# EAGLE design BMS Microcontroller (EAGLE 7.7.0)
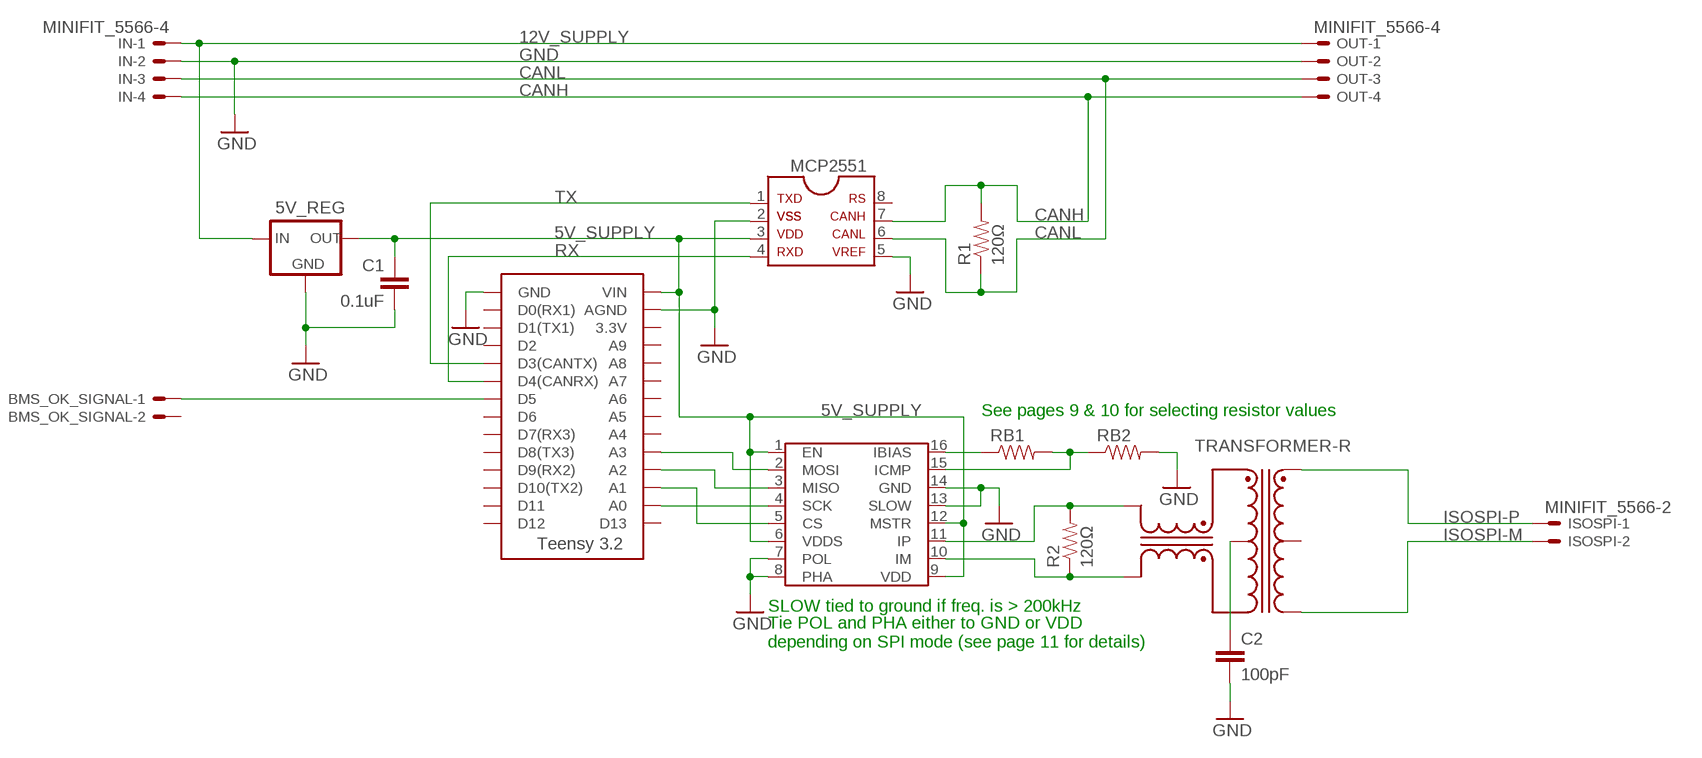
[diagram p0: schematic, sheet 1]

## Parts
5V_REG  5V_REGULATOR_LM340-NLM340MPX-5.0/NOPB  [SOT223]
BMS_OK_SIGNAL  MINIFIT_5566-2  [MINIFIT_5566-2]
C1  0.1uF  CAP0805  [0805]
C2  100pF  CAP0805  [0805]
IN  MINIFIT_5566-4  [MINIFIT_5566-4]
ISOSPI  MINIFIT_5566-2  [MINIFIT_5566-2]
MCP2551  MCP2551  [SOIC-08]
OUT  MINIFIT_5566-4  [MINIFIT_5566-4]
R1  120Ω  RESISTOR0805-RES  [0805]
R2  120Ω  RESISTOR0805-RES  [0805]
RB1  RESISTOR0805-RES  [0805]
RB2  RESISTOR0805-RES  [0805]
TRANSFORMER-  TRANSFORMER_749010013  [749010013]
U$1  LTC6820  [LTC6820]
U$3  TEENSY_3.2_SIMPLE  [TEENSY_3.2_SIMPLE]

## Nets
5V_SUPPLY: 5V_REG.3(OUT) C1.1 MCP2551.3 U$1.1(EN) U$1.6(VDDS) U$1.9(VDD) U$1.12(MSTR) U$3.VIN
12V_SUPPLY: 5V_REG.1(IN) IN.1 OUT.1
CANH: IN.4 MCP2551.7 OUT.4 R1.2
CANL: IN.3 MCP2551.6 OUT.3 R1.1
GND: 5V_REG.2(GND) 5V_REG.4(GND) C1.2 C2.2 IN.2 MCP2551.2 MCP2551.5 OUT.2 RB2.2 U$1.7(POL) U$1.8(PHA) U$1.13(SLOW) U$1.14(GND) U$3.AGND U$3.GND
ISOSPI-M: ISOSPI.2 TRANSFORMER-.8(R:D-)
ISOSPI-P: ISOSPI.1 TRANSFORMER-.6(R:D+)
N$1: U$1.5(CS) U$3.A1
N$2: U$1.4(SCK) U$3.A0
N$3: U$1.3(MISO) U$3.A2
N$4: U$1.2(MOSI) U$3.A3
N$5: C2.1 TRANSFORMER-.10(R:CX)
N$6: RB1.1 U$1.16(IBIAS)
N$7: RB1.2 RB2.1 U$1.15(ICMP)
N$8: R2.2 TRANSFORMER-.11(R:X+) U$1.11(IP)
N$9: R2.1 TRANSFORMER-.9(R:X-) U$1.10(IM)
N$10: BMS_OK_SIGNAL.1 U$3.D5
RX: MCP2551.4 U$3.D4(CANRX)
TX: MCP2551.1 U$3.D3(CANTX)
Unconnected: BMS_OK_SIGNAL.2 MCP2551.8 TRANSFORMER-.1(T:D+) TRANSFORMER-.2(T:CD) TRANSFORMER-.3(T:D-) TRANSFORMER-.7(R:CD) TRANSFORMER-.14(T:X-) TRANSFORMER-.15(T:CX) TRANSFORMER-.16(T:X+) U$3.3.3V U$3.A4 U$3.A5 U$3.A6 U$3.A7 U$3.A8 U$3.A9 U$3.D0(RX1) U$3.D1(TX1) U$3.D2 U$3.D6 U$3.D7(RX3) U$3.D8(TX3) U$3.D9(RX2) U$3.D10(TX2) U$3.D11 U$3.D12 U$3.D13

## Notes on the sheet
- See pages 9 & 10 for selecting resistor values
- SLOW tied to ground if freq. is > 200kHz
- Tie POL and PHA either to GND or VDD
  depending on SPI mode (see page 11 for details)

## Library data of the parts
5V_REG = HyTechDevices:5V_REGULATOR_LM340-N: Voltage Regulator 5v linear voltage regulator Datasheet <http://www.mouser.com/ProductDetail/Texas-Instruments/LM340MPX-50-NOPB/?qs=X1J7HmVL2ZGZwtTFRQ9ItA%3D%3D> MAX current out: 1.5A MAX voltage in: 35V
BMS_OK_SIGNAL ISOSPI = HyTechDevices:MINIFIT_5566-2: Mini-Fit Junior connector 2 pole Source: http://www.molex.com; OC_FARNELL: 1822072; OC_NEWARK: unknown
C1 C2 = HyTechDevices:CAP: Capacitor Standard 0603 ceramic capacitor, and 0.1" leaded capacitor.
IN OUT = HyTechDevices:MINIFIT_5566-4: Mini-Fit Junior connector 4 pole Source: http://www.molex.com; OC_FARNELL: unknown; OC_NEWARK: unknown
MCP2551 = HyTechDevices:MCP2551: MCP2551 High-Speed CAN Transceiver Product Webpage <https://www.microchip.com/wwwproducts/en/MCP2551> Datasheet <http://ww1.microchip.com/downloads/en/DeviceDoc/21667f.pdf> This device is outdated It is replaced by MCP2561. Comparison Page <https://www.microchip.com/wwwproducts/ProductCompare/MCP2551/MCP2561> Product Webpage <https://www.microchip.com/wwwproducts/en/MCP2561> Datasheet <http://ww1.microchip.com/downloads/en/DeviceDoc/20005167C.pdf>
R1 R2 RB1 RB2 = HyTechDevices:RESISTOR: Resistor Basic schematic elements and footprints for 0603, 1206, and PTH resistors.
TRANSFORMER- = HyTechDevices:TRANSFORMER_749010013: Wurth Electronics Midcom 749010013 10/100BaseTX Ethernet Transformer Datasheet <http://www.mouser.com/ds/2/445/749010013-311000.pdf> Mouser Page <http://www.mouser.com/ProductDetail/Wurth-Electronics-Midcom/749010013/?qs=40TFAHZMFvcjCZphxWYgVw%3D%3D>
U$1 = HyTechDevices:LTC6820: Linear Technology LTC6820 isoSPI Isolated Communications Interface Datasheet <http://cds.linear.com/docs/en/datasheet/6820fa.pdf>
U$3 = HyTechDevices:TEENSY_3.2_SIMPLE: Simple version of the Teensy 3.2 board that only uses the 2 main rows of pins, not the inner pins or the pins opposite the usb port.

## Board
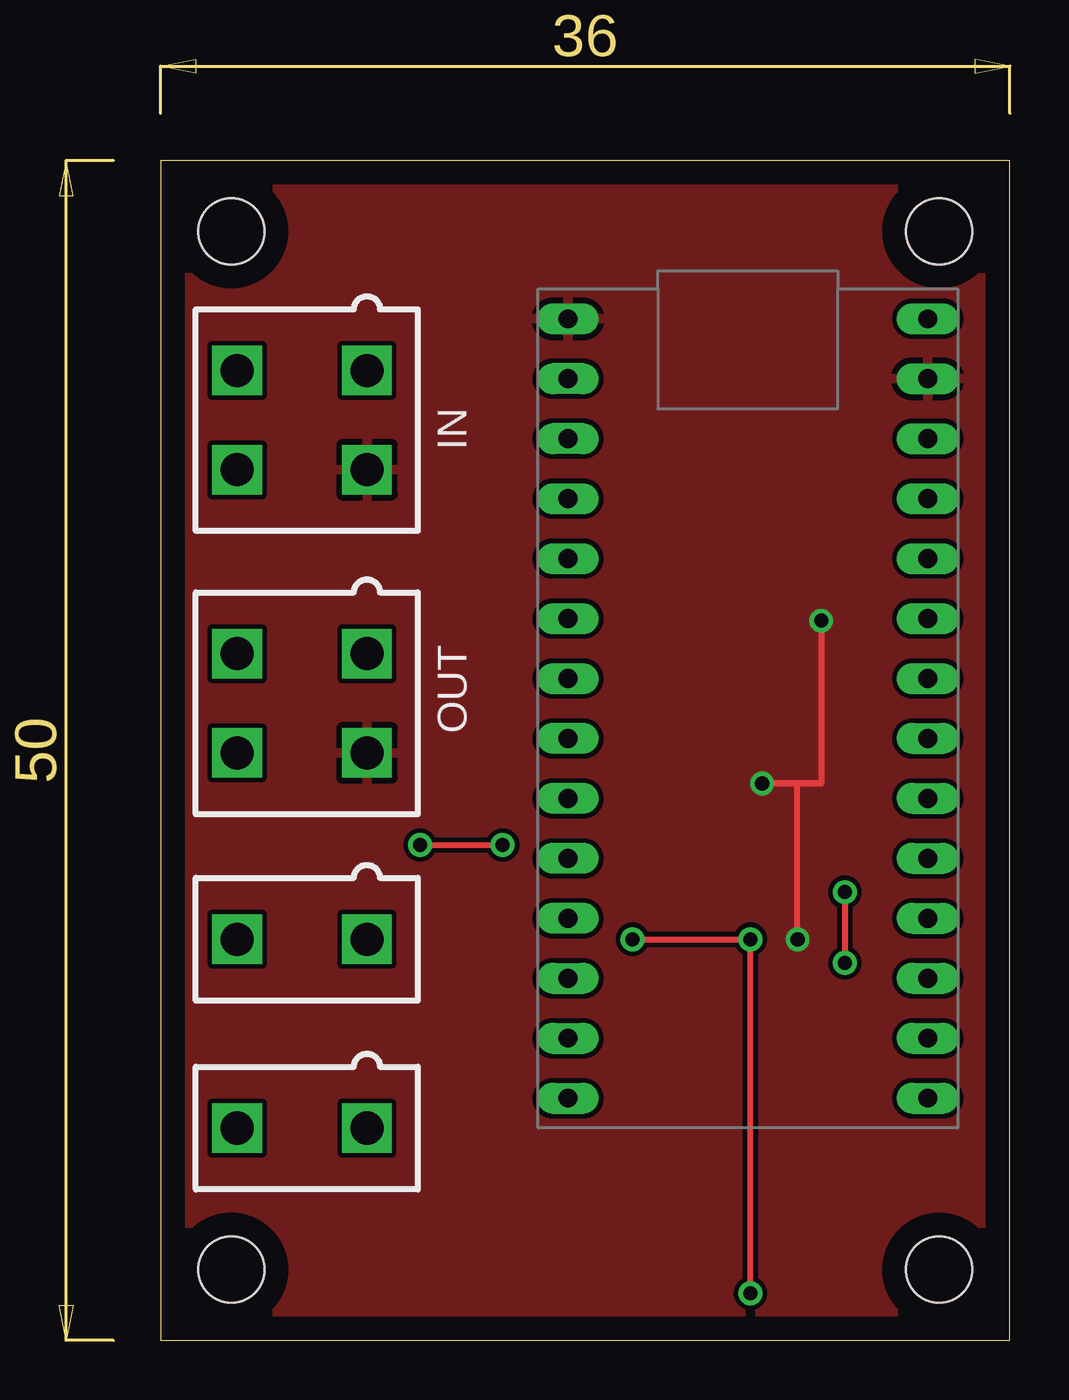
[diagram p1: board, top side]
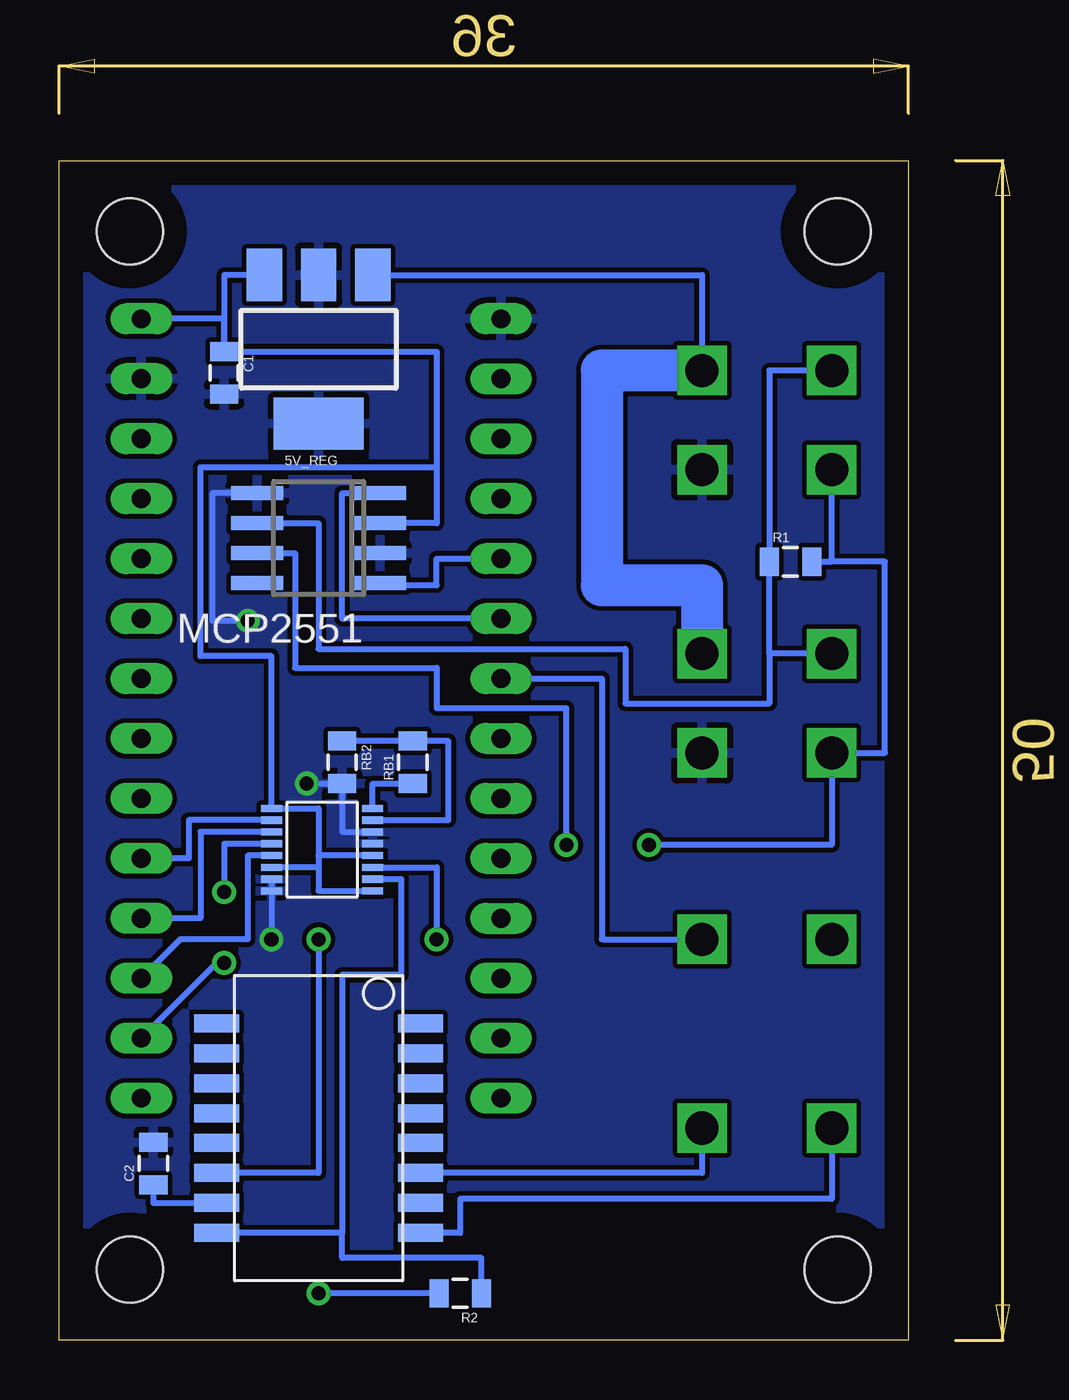
[diagram p2: board, bottom side, seen from below]

Size 36 x 50 mm. Coordinates in mm from the lower left corner, seen from the top.
Outline: 0,0 36,0 36,50 0,50 0,0
Copper layers (1*16): Top 0.035mm / dielectric 1.5mm / Bottom 0.035mm
Design rules "default": minimum track width 10mil, minimum drill 24mil, track to track 8mil, track to pad 8mil, pad to pad 8mil, via to via 8mil, smd to smd 8mil, copper to edge 40mil, drill to drill 8mil, minimum pad ring 10mil, minimum via ring 8mil, stop-mask expansion 4mil, vias tented up to drill 0mil, thermal gap 10mil
Holes 2.8 mm at 3,47 33,47 3,3 33,3

### Footprints (pad centres in the part's own frame; a part is rotated, then mirrored left to right if it is on the bottom)
SOT223 = smd 1.5 x 2.235: 1 -2.3,-3.15; 2 0,-3.15; 3 2.3,-3.15 | smd 3.8 x 2.2: 4 0,3.15
MINIFIT_5566-2 = drill 1.4 square: 1 0,-2.75; 2 0,2.75
0805 = smd 0.8 x 1.2: 1 -0.9,0; 2 0.9,0
MINIFIT_5566-4 = drill 1.4 square: 1 2.1,-2.75; 2 -2.1,-2.75; 3 2.1,2.75; 4 -2.1,2.75
SOIC-08 = smd 0.6 x 2.2: 1 -1.905,-2.6; 2 -0.635,-2.6; 3 0.635,-2.6; 4 1.905,-2.6; 5 1.905,2.6; 6 0.635,2.6; 7 -0.635,2.6; 8 -1.905,2.6
749010013 = smd 1.905 x 0.762: 1 4.318,4.445; 2 4.318,3.175; 3 4.318,1.905; 4 4.318,0.635; 5 4.318,-0.635; 6 4.318,-1.905; 7 4.318,-3.175; 8 4.318,-4.445; 9 -4.318,-4.445; 10 -4.318,-3.175; 11 -4.318,-1.905; 12 -4.318,-0.635; 13 -4.318,0.635; 14 -4.318,1.905; 15 -4.318,3.175; 16 -4.318,4.445
LTC6820 = smd 0.305 x 0.889: 1 -1.75,-2.14; 2 -1.25,-2.14; 3 -0.75,-2.14; 4 -0.25,-2.14; 5 0.25,-2.14; 6 0.75,-2.14; 7 1.25,-2.14; 8 1.75,-2.14; 9 1.75,2.14; 10 1.25,2.14; 11 0.75,2.14; 12 0.25,2.14; 13 -0.25,2.14; 14 -0.75,2.14; 15 -1.25,2.14; 16 -1.75,2.14
TEENSY_3.2_SIMPLE = drill 0.8 long: 3.3V 16.51,29.21; A0 16.51,3.81; A1 16.51,6.35; A2 16.51,8.89; A3 16.51,11.43; A4 16.51,13.97; A5 16.51,16.51; A6 16.51,19.05; A7 16.51,21.59; A8 16.51,24.13; A9 16.51,26.67; AGND 16.51,31.75; D0(RX1) 1.27,31.75; D1(TX1) 1.27,29.21; D2 1.27,26.67; D3(CANTX) 1.27,24.13; D4(CANRX) 1.27,21.59; D5 1.27,19.05; D6 1.27,16.51; D7(RX3) 1.27,13.97; D8(TX3) 1.27,11.43; D9(RX2) 1.27,8.89; D10(TX2) 1.27,6.35; D11 1.27,3.81; D12 1.27,1.27; D13 16.51,1.27; GND 1.27,34.29; VIN 16.51,34.29

### Placement (x,y rotation side)
5V_REG  25,42 180 bottom
BMS_OK_SIGNAL  6,17 90 top
C1  29,41 270 bottom
C2  32,7.5 90 bottom
IN  6,39 90 top
ISOSPI  6,9 90 top
MCP2551  25,34 90 bottom
OUT  6,27 90 top
R1  5,33 0 bottom
R2  19,2 180 bottom
RB1  21,24.5 90 bottom
RB2  24,24.5 270 bottom
TRANSFORMER-  25,9 0 bottom
U$1  24.85,20.8 270 bottom
U$3  16,9 0 top

### Tracks (layer width: path | path; a pad name or v marks a point on that pad's centre or on a via)
5V_SUPPLY
  Bottom 0.254: 5V_REG.3 29,45.15 C1.1 | C1.1 20,41.9 20,37 | 20,37 20,34.63 MCP2551.3 | C1.1 29,43.29 U$3.VIN | 20,37 30,37 30,29 26.99,29 U$1.1 25,22.55 25,20.55 | U$1.12 25,20.55 | 25,20.05 25,19.05 U$1.9 | 25,20.05 U$1.6 | 25,20.55 25,20.05
12V_SUPPLY
  Bottom 0.254: 5V_REG.1 8.75,45.15 IN.1
  Bottom 1.778: IN.1 13,41.1 13,32 8.75,32 OUT.1
CANH  (via drill 0.6)
  Top 0.254: v11,21 v14.5,21
  Bottom 0.254: R1.2 3.25,33 | 3.25,33 IN.4 | 3.25,33 1,33 1,24.9 OUT.4 3.25,21 v11,21 | MCP2551.7 26,33.37 26,28.5 20,28.5 20,26.8 14.5,26.8 v14.5,21
CANL
  Bottom 0.254: IN.3 5.9,41.1 R1.1 5.9,29.1 | OUT.3 5.9,29.1 | 5.9,29.1 5.9,27 12,27 12,29.3 25,29.3 25,34.63 MCP2551.6
GND  (via drill 0.6)
  Top 0.254: v28,30.5 28,23.6 27,23.6 | v27,17 27,23.6 | 27,23.6 v25.5,23.6
  Bottom 0.254: U$1.14 24,21.55 RB2.2 v25.5,23.6 | MCP2551.5 29.5,35.91 29.5,30.5 v28,30.5 | U$1.7 v26.99,17 v27,17
  pour Bottom: -1,51 37,51 37,-1 -1,-1
  pour Top: -2,-2 38,-2 38,52 -2,52
ISOSPI-M
  Bottom 0.254: ISOSPI.2 3.25,6 19,6 19,4.55 TRANSFORMER-.8
ISOSPI-P
  Bottom 0.254: ISOSPI.1 8.75,7.09 TRANSFORMER-.6
N$1
  Bottom 0.254: U$1.5 28,20.55 28,17 30.86,17 U$3.A1
N$2  (via drill 0.6)
  Top 0.254: v29,19 v29,16
  Bottom 0.254: U$1.4 29,21.05 v29,19 | v29,16 29.32,16 U$3.A0
N$3
  Bottom 0.254: U$1.3 30,21.55 30,17.89 U$3.A2
N$4
  Bottom 0.254: U$1.2 30.5,22.05 30.5,20.43 U$3.A3
N$5
  Bottom 0.254: C2.1 32,5.83 TRANSFORMER-.10
N$6
  Bottom 0.254: U$1.16 22.71,23.6 RB1.1
N$7
  Bottom 0.254: U$1.15 19.5,22.05 19.5,25.4 RB1.2 RB2.1
N$8  (via drill 0.6)
  Top 0.254: v20,17 v25,17 v25,2
  Bottom 0.254: U$1.11 20,20.05 v20,17 | v25,17 25,7.09 TRANSFORMER-.11 | R2.2 v25,2
N$9
  Bottom 0.254: U$1.10 21.5,19.55 21.5,15.5 24,15.5 24,4.55 | 24,4.55 TRANSFORMER-.9 | R2.1 18.1,3.5 24,3.5 24,4.55
N$10
  Bottom 0.254: U$3.D5 13,28.05 13,17 BMS_OK_SIGNAL.1
RX
  Bottom 0.254: U$3.D4(CANRX) 24,30.59 24,35.91 MCP2551.4
TX
  Bottom 0.254: MCP2551.1 22.4,32 20,32 20,33.13 U$3.D3(CANTX)